# Altium project Э4.PrjPcb
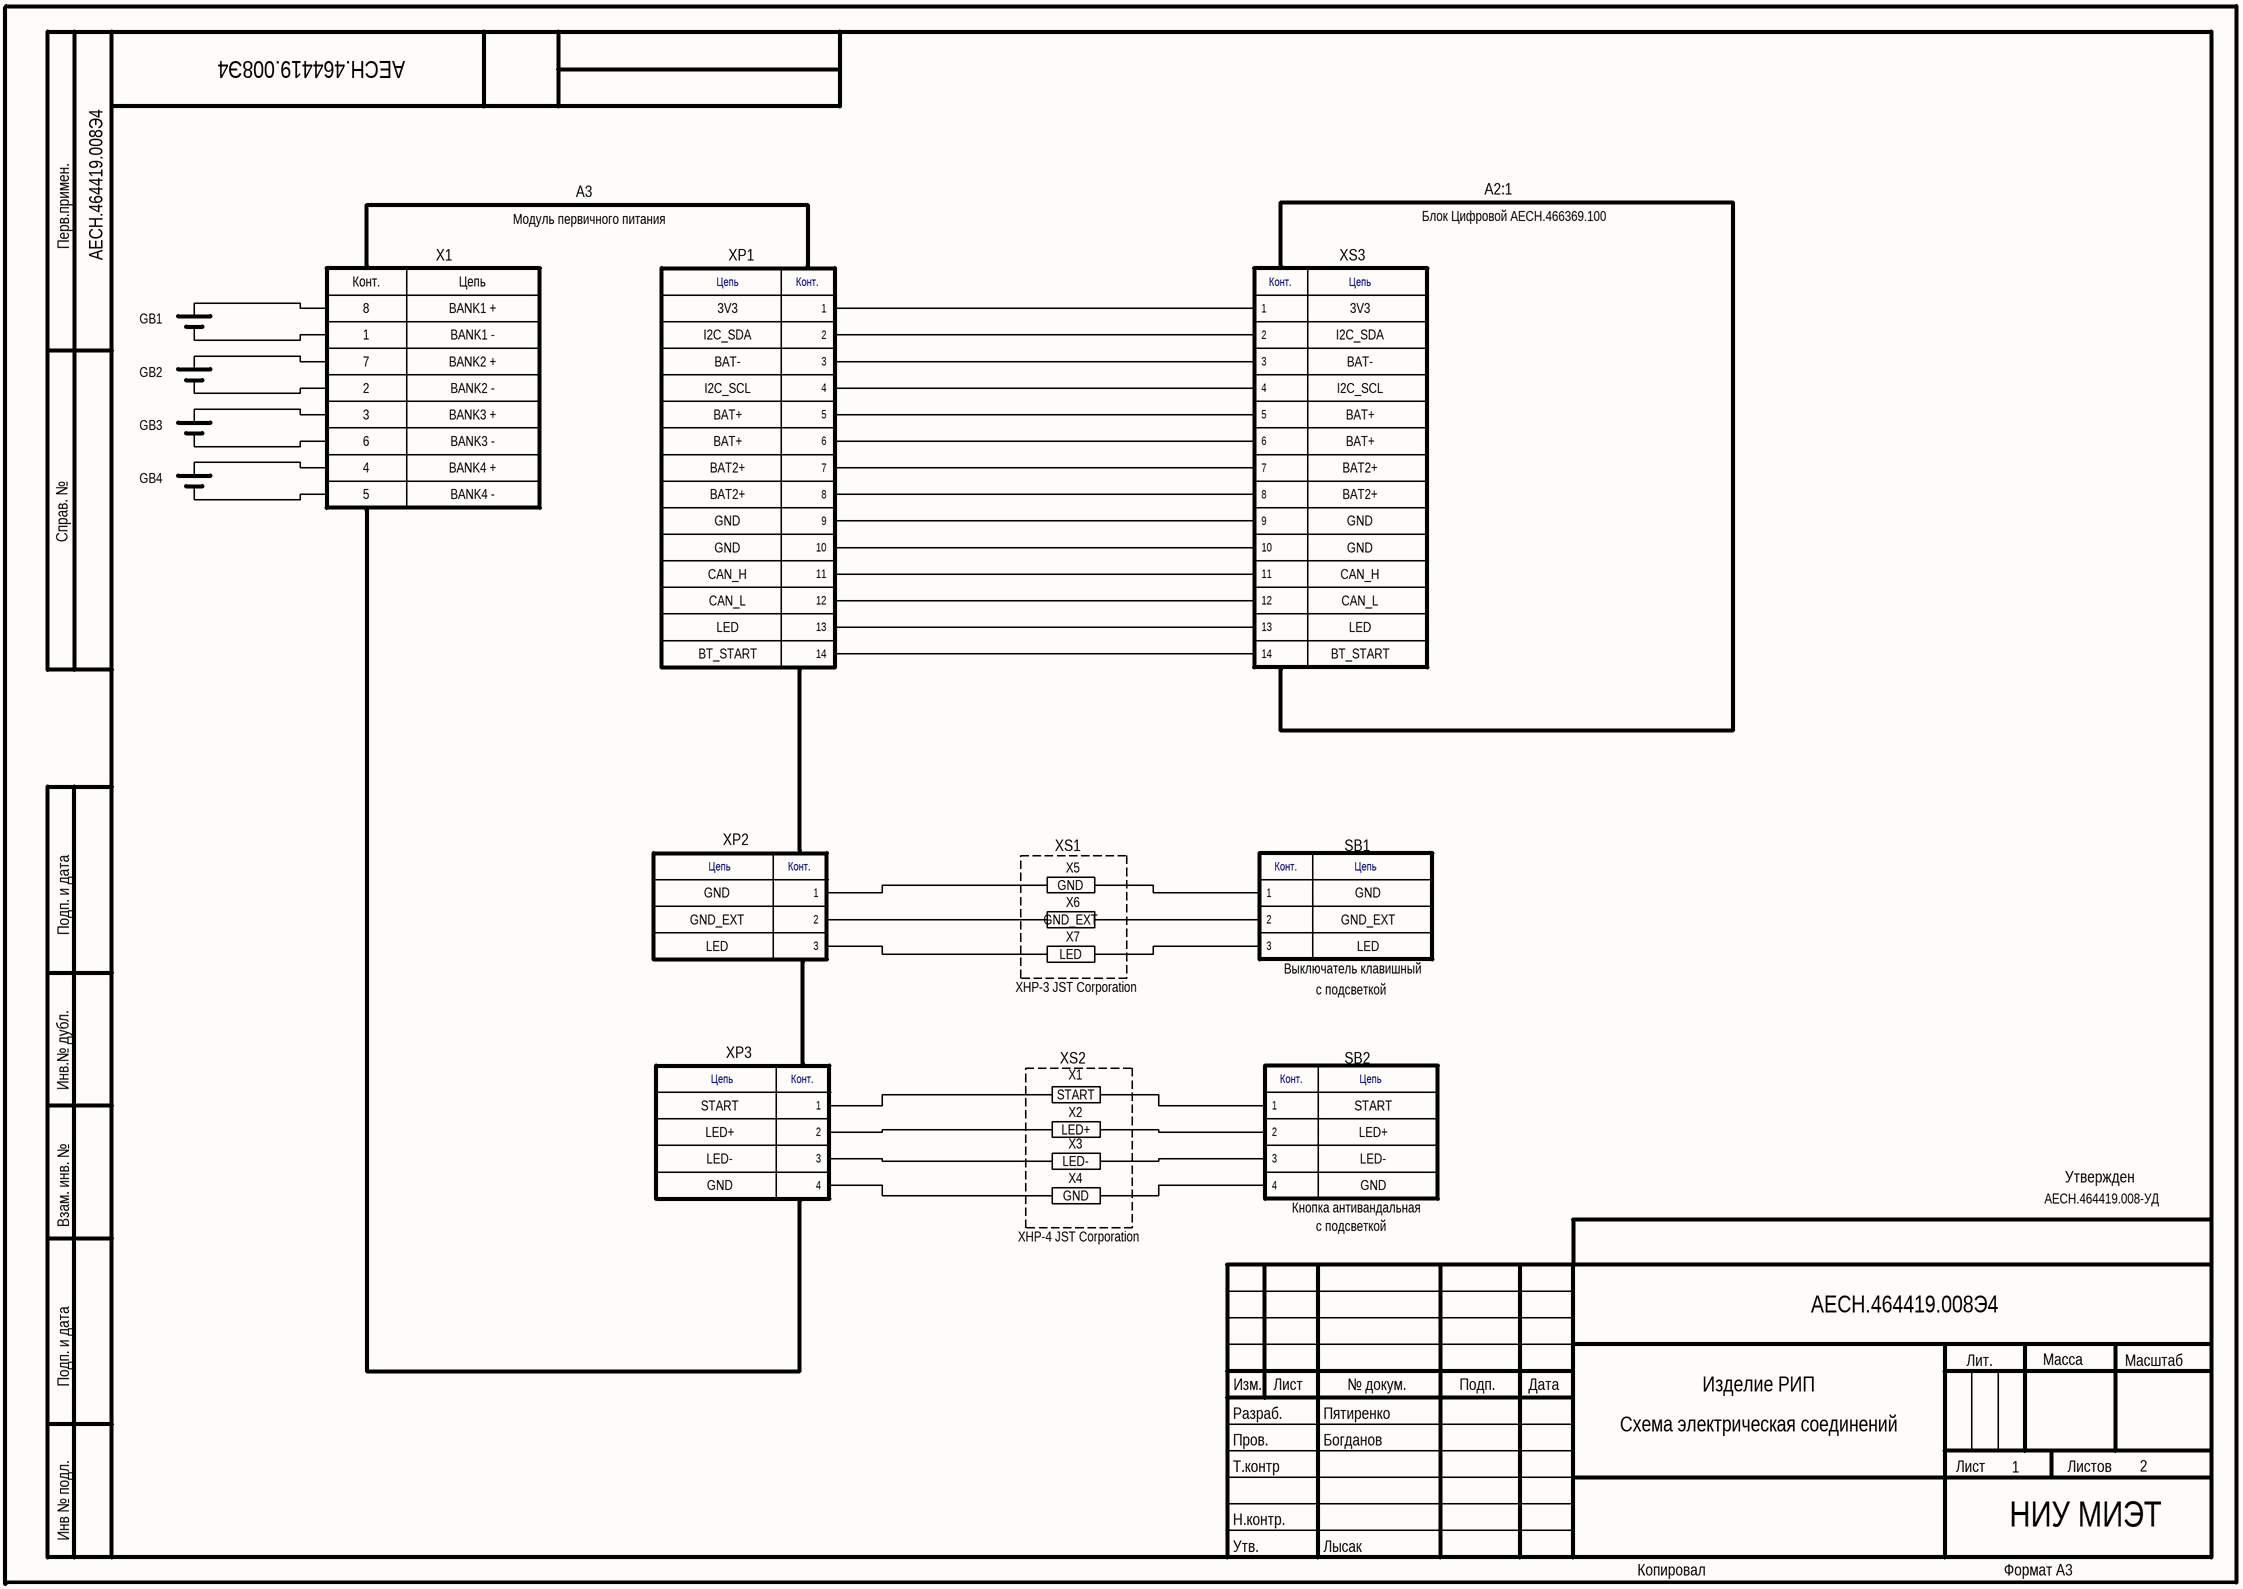
[diagram p0: Э4_1.SchDoc]
2 sheets, 21 parts. Net scope: global (net labels, ports and power ports of the same name join across sheets).
Sheets:
  Э4_1.SchDoc
  Э4_2.SchDoc

## Sheet Э4_1.SchDoc: Изделие РИП
size 420 x 297 mm; ApprovedBy: Лысак; CheckedBy: Богданов; Author: Пятиренко; DocumentNumber: АЕСН.464419.008Э4; SheetNumber: 1; SheetTotal: 2; Title2: Схема электрическая соединений; PERVICH PRIM: АЕСН.464419.008Э4

### Parts
1  Battery  (value not drawn)
2  Battery  (value not drawn)
3  Battery  (value not drawn)
4  Battery  (value not drawn)
X1  connector for batteries  (value not drawn)
XP1  14pin  [PBD-14]  (value not drawn)
XP2  3pin  [B3B-XH-A]  (value not drawn)
XP3  4pin  [СI1104М1V]  (value not drawn)
XS2  3pin  [B3B-XH-A]  (value not drawn)
XS3  14pin  [PBD-14]  (value not drawn)
XS?  4pin  [СI1104М1V]  (value not drawn)

### Nets
Net1_VREF: 1.VREF X1.1
Net1_VREF: 1.VREF X1.2  [a separate net that carries the same name]
Net2_VREF: 2.VREF X1.3
Net2_VREF: 2.VREF X1.4  [a separate net that carries the same name]
Net3_VREF: 3.VREF X1.5
Net3_VREF: 3.VREF X1.6  [a separate net that carries the same name]
Net4_VREF: 4.VREF X1.7
Net4_VREF: 4.VREF X1.8  [a separate net that carries the same name]
NetXP1_1: XP1.1 XS3.1
NetXP1_2: XP1.2 XS3.2
NetXP1_3: XP1.3 XS3.3
NetXP1_4: XP1.4 XS3.4
NetXP1_5: XP1.5 XS3.5
NetXP1_6: XP1.6 XS3.6
NetXP1_7: XP1.7 XS3.7
NetXP1_8: XP1.8 XS3.8
NetXP1_9: XP1.9 XS3.9
NetXP1_10: XP1.10 XS3.10
NetXP1_11: XP1.11 XS3.11
NetXP1_12: XP1.12 XS3.12
NetXP1_13: XP1.13 XS3.13
NetXP1_14: XP1.14 XS3.14

Not connected (* = marked no-connect by the designer): XP2 1 2 3; XP3 1 2 3 4; XS2 1 2 3; XS? 1 2 3 4

### Notes on the sheet
- A3
- A2:1
- Модуль первичного питания
- Блок Цифровой АЕСН.466369.100
- (near 1) GB1
- I2C_SDA
- 3V3
- GB2
- I2C_SCL
- BAT-
- GB3
- BAT2+
- BAT+
- GB4
- GND
- CAN_H
- CAN_L
- LED
- BT_START
- XS1
- SB1
- GND_EXT
- X5
- X6
- XHP-3 JST Corporation
- X7
- (near XS2) Выключатель клавишный
- с подсветкой
- XS2
- SB2
- START
- LED+
- X1
- X2
- LED-
- X3
- X4
- Утвержден
- АЕСН.464419.008-УД
- XHP-4 JST Corporation
- (near XS?) Кнопка антивандальная
- НИУ МИЭТ
- Перв.примен.
- Справ. №
- Подп. и дата
- Инв.№ дубл.
- Взам. инв. №
- Изм.
- Лист
- № докум.
- Подп.
- Дата
- Лит.
- Масса
- Масштаб
- Пров.
- Т.контр
- Разраб.
- Листов
- Инв № подл.
- Н.контр.
- Утв.
- Копировал
- Формат А3
- (in symbol 3pin) Конт.; Цепь
- (in symbol 4pin) Конт.; Цепь
- (in symbol 14pin) Конт.; Цепь
- (in symbol connector for batteries) Конт.; Цепь; BANK1 +; BANK1 -; BANK2 +; BANK2 -; BANK3 +; BANK3 -; BANK4 +; BANK4 -

### Library data of the parts
XP1 XS3 = 14pin: Manufacturer: *; PartNumber: *
XP2 XS2 = 3pin: Manufacturer: *; PartNumber: B3B-XH-A
XP3 XS? = 4pin: Manufacturer: *; PartNumber: *

## Sheet Э4_2.SchDoc
size 420 x 297 mm; DocumentNumber: АЕСН.464419.008Э4; SheetNumber: 2; PERVICH_PRIM: АЕСН.464419.008Э4
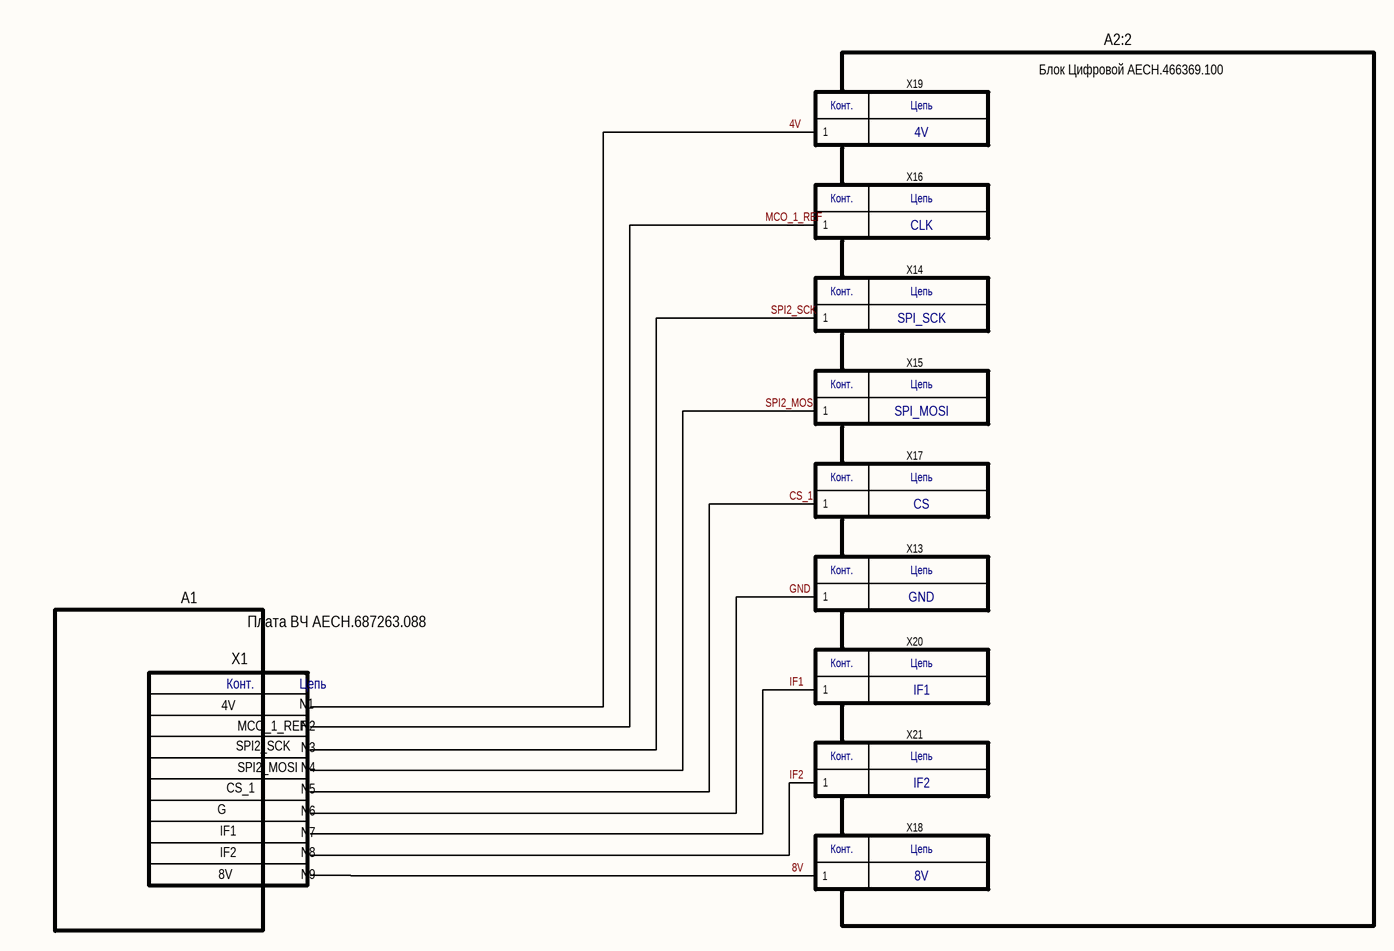
[diagram p1: Э4_2.SchDoc]

### Parts
*?  A1-Плата ВЧ  (value not drawn)
X13  1pin  [lam 4x2]  (value not drawn)
X14  1pin  [lam 4x2]  (value not drawn)
X15  1pin  [lam 4x2]  (value not drawn)
X16  1pin  [lam 4x2]  (value not drawn)
X17  1pin  [lam 4x2]  (value not drawn)
X18  1pin  [lam 4x2]  (value not drawn)
X19  1pin  [lam 4x2]  (value not drawn)
X20  1pin  [lam 4x2]  (value not drawn)
X21  1pin  [lam 4x2]  (value not drawn)

### Nets
4V: *?.8 X19.1
CS_1: *?.4 X17.1
GND: *?.3 X13.1
IF1: *?.2 X20.1
IF2: *?.1 X21.1
MCO_1_REF: *?.7 X16.1
SPI2_MOSI: *?.5 X15.1
SPI2_SCK: *?.6 X14.1
Net*?_0: *?.0 X18.1

### Notes on the sheet
- A2:2
- 4V
- Блок Цифровой АЕСН.466369.100
- CLK
- SPI_SCK
- SPI_MOSI
- CS
- GND
- A1
- X1
- Плата ВЧ АЕСН.687263.088
- IF1
- IF2
- 8V
- Labels drawn without touching a wire or pin: 8V
- Подп. и дата
- Инв.№ дубл.
- Взам. инв. №
- Инв № подл.
- Изм.
- Лист
- № докум.
- Подп.
- Дата
- Копировал
- Формат А3
- (in symbol 1pin) Конт.; Цепь
- (in symbol A1-Плата ВЧ) Конт.; Цепь; 4V; N1; MCO_1_REF; N2; SPI2_SCK; N3; SPI2_MOSI; N4; CS_1; N5; G; N6; IF1; N7; IF2; N8; 8V; N9

### Library data of the parts
X13-X21 = 1pin: Manufacturer: *; PartNumber: *